# EAGLE design right_revision1_1 (EAGLE 7.2.0)
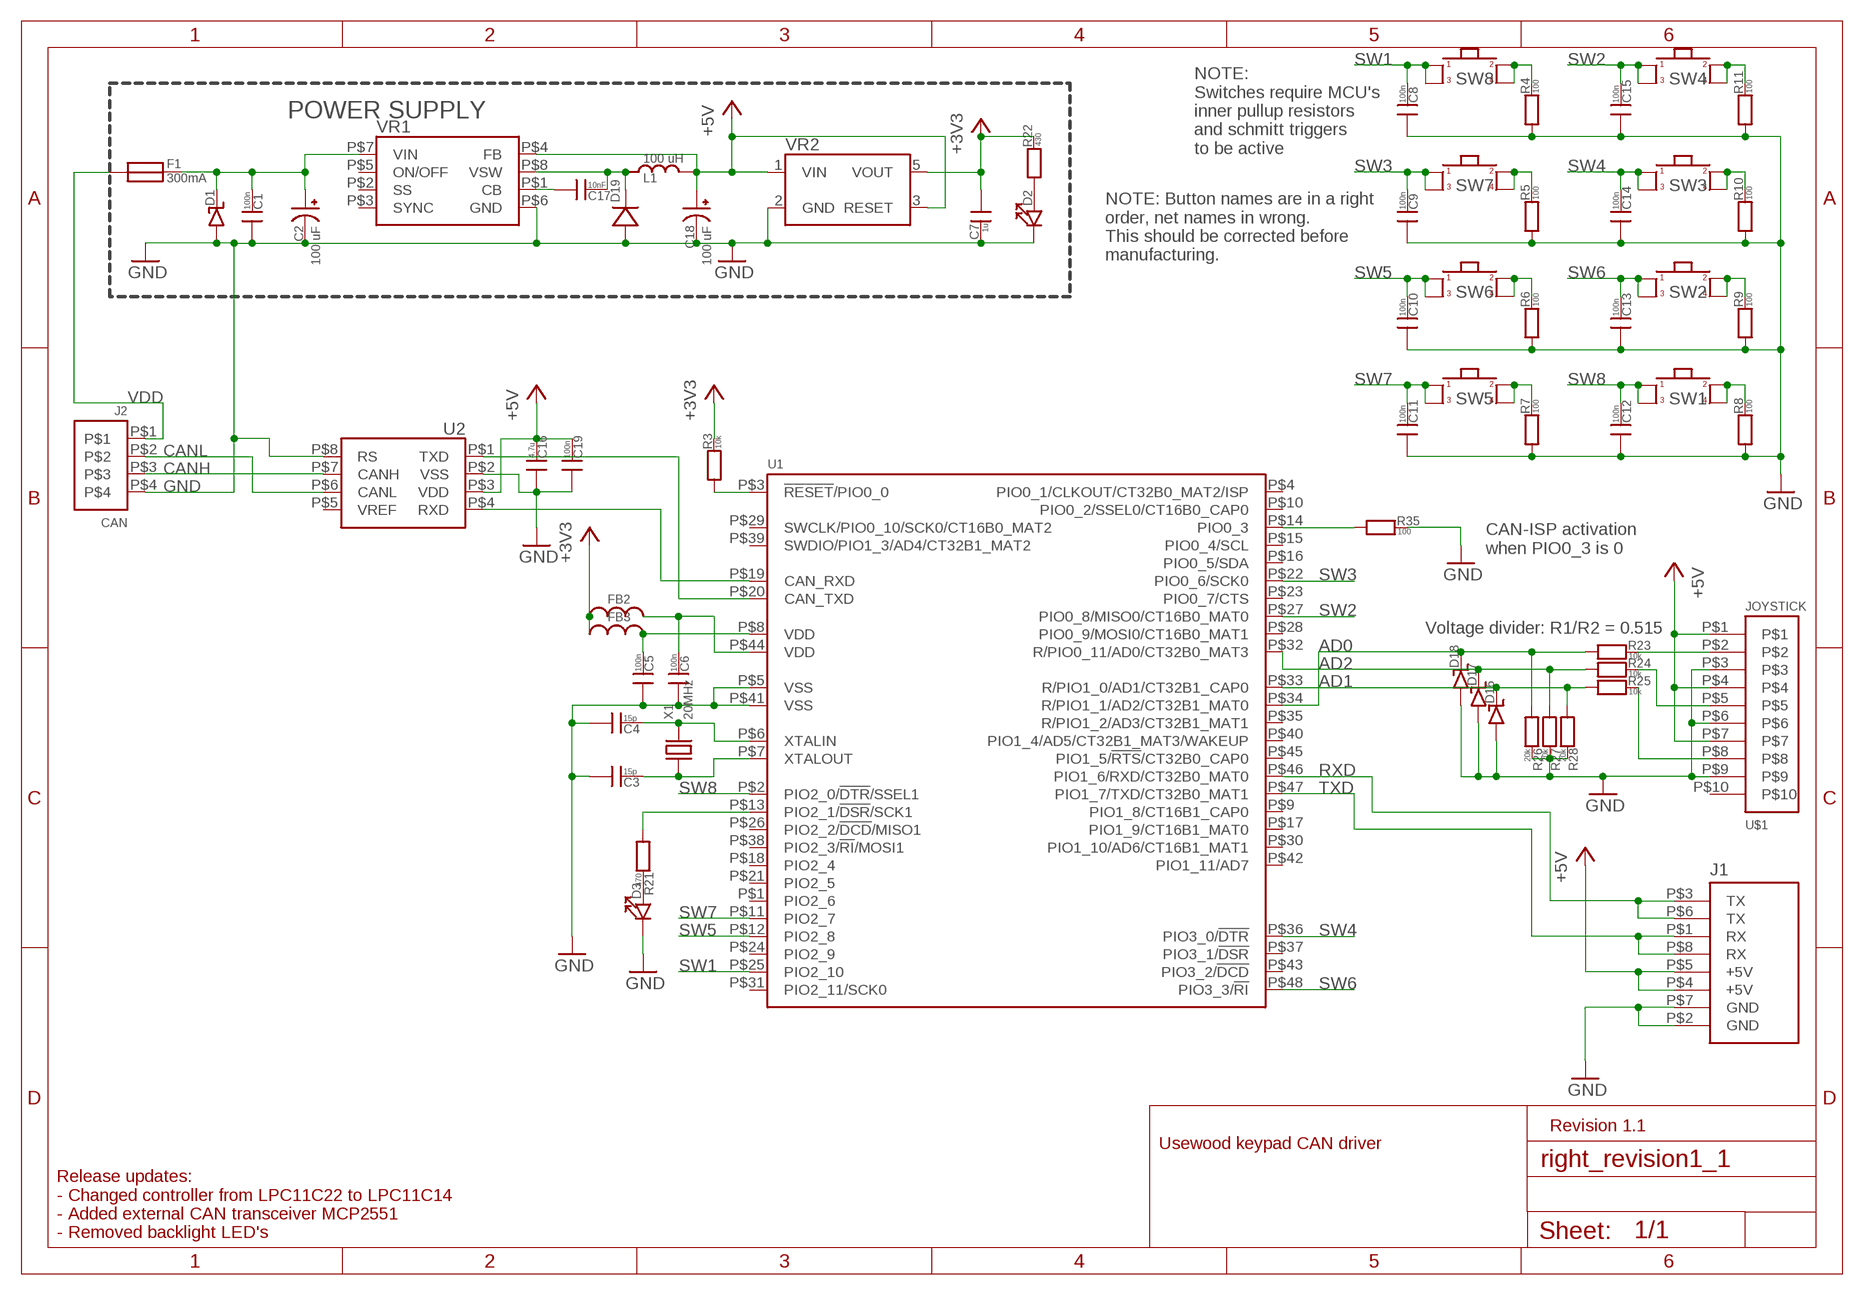
[diagram p0: schematic, sheet 1]

## Parts
C1  100n  CAP0603_SILKSCREEN  [0603_SILKSCREEN]
C2  100 uF  CAP_POLSMD_10X10X10MM  [CAP_POL_SMD_10X10X10MM]
C3  15p  CAP0603_SILKSCREEN  [0603_SILKSCREEN]
C4  15p  CAP0603_SILKSCREEN  [0603_SILKSCREEN]
C5  100n  CAP0603_SILKSCREEN  [0603_SILKSCREEN]
C6  100n  CAP0603_SILKSCREEN  [0603_SILKSCREEN]
C7  1u  CAP0603_SILKSCREEN  [0603_SILKSCREEN]
C8  100n  CAP0603_SILKSCREEN  [0603_SILKSCREEN]
C9  100n  CAP0603_SILKSCREEN  [0603_SILKSCREEN]
C10  100n  CAP0603_SILKSCREEN  [0603_SILKSCREEN]
C11  100n  CAP0603_SILKSCREEN  [0603_SILKSCREEN]
C12  100n  CAP0603_SILKSCREEN  [0603_SILKSCREEN]
C13  100n  CAP0603_SILKSCREEN  [0603_SILKSCREEN]
C14  100n  CAP0603_SILKSCREEN  [0603_SILKSCREEN]
C15  100n  CAP0603_SILKSCREEN  [0603_SILKSCREEN]
C16  4.7u  CAP0603_SILKSCREEN  [0603_SILKSCREEN]
C17  10nF  CAP0603_SILKSCREEN  [0603_SILKSCREEN]
C18  100 uF  CAP_POLSMD_10X10X10MM  [CAP_POL_SMD_10X10X10MM]
C19  100n  CAP0603_SILKSCREEN  [0603_SILKSCREEN]
D1  DIODE_TVSDO-214AA  [DO-214AB]
D2  LED0603_SILKSCREEN  [0603_SILKSCREEN]
D3  LED0603_SILKSCREEN  [0603_SILKSCREEN]
D16  DIODE_ZENERSDO123  [SOD123]
D17  DIODE_ZENERSDO123  [SOD123]
D18  DIODE_ZENERSDO123  [SOD123]
D19  DIODEDO219AB  [DO219AB]
F1  300mA  FUSE100MA  [FUSE_100MA]
FB2  FERRITE0603_SILKSCREEN  [0603_SILKSCREEN]
FB3  FERRITE0603_SILKSCREEN  [0603_SILKSCREEN]
J1  HEADER_USART_2_TH  [HEADER_USART_2_TH]
J2  CAN  MOLEX_MICRO-FIT_4WAYTH  [MOLEX_MICRO-FIT_4WAY]
L1  100 uH  INDUCTORBOURNS_10X13X5MM  [INDUCTOR_BOURNS_10X13X5MM]
R3  10k  RES0604_SILKSCREEN  [0603_SILKSCREEN]
R4  100  RES0604_SILKSCREEN  [0603_SILKSCREEN]
R5  100  RES0604_SILKSCREEN  [0603_SILKSCREEN]
R6  100  RES0604_SILKSCREEN  [0603_SILKSCREEN]
R7  100  RES0604_SILKSCREEN  [0603_SILKSCREEN]
R8  100  RES0604_SILKSCREEN  [0603_SILKSCREEN]
R9  100  RES0604_SILKSCREEN  [0603_SILKSCREEN]
R10  100  RES0604_SILKSCREEN  [0603_SILKSCREEN]
R11  100  RES0604_SILKSCREEN  [0603_SILKSCREEN]
R21  470  RES0604_SILKSCREEN  [0603_SILKSCREEN]
R22  430  RES0604_SILKSCREEN  [0603_SILKSCREEN]
R23  10k  RES0604_SILKSCREEN  [0603_SILKSCREEN]
R24  10k  RES0604_SILKSCREEN  [0603_SILKSCREEN]
R25  10k  RES0604_SILKSCREEN  [0603_SILKSCREEN]
R26  20k  RES0604_SILKSCREEN  [0603_SILKSCREEN]
R27  20k  RES0604_SILKSCREEN  [0603_SILKSCREEN]
R28  20k  RES0604_SILKSCREEN  [0603_SILKSCREEN]
R35  100  RES0604_SILKSCREEN  [0603_SILKSCREEN]
SW1  SWITCH12X12MM_CENTER_HOLE  [SWITCH_12X12MM_CENTER_HOLE]
SW2  SWITCH12X12MM_CENTER_HOLE  [SWITCH_12X12MM_CENTER_HOLE]
SW3  SWITCH12X12MM_CENTER_HOLE  [SWITCH_12X12MM_CENTER_HOLE]
SW4  SWITCH12X12MM_CENTER_HOLE  [SWITCH_12X12MM_CENTER_HOLE]
SW5  SWITCH12X12MM_CENTER_HOLE  [SWITCH_12X12MM_CENTER_HOLE]
SW6  SWITCH12X12MM_CENTER_HOLE  [SWITCH_12X12MM_CENTER_HOLE]
SW7  SWITCH12X12MM_CENTER_HOLE  [SWITCH_12X12MM_CENTER_HOLE]
SW8  SWITCH12X12MM_CENTER_HOLE  [SWITCH_12X12MM_CENTER_HOLE]
U1  LPC11C14_QFP48  [QFP48]
U2  MCP2551_SOIC8  [SOIC8]
U$1  JOYSTICK  MOLEX_MICRO-FIT_10WAYTH  [MOLEX-MICRO-FIT_10WAY]
VR1  LM2671SOIC8  [SOIC8]
VR2  LP2985SOP5  [SOP5]
X1  20MHz  XTALSMD_5X3.2  [XTAL_SMD_5X3.2]

## Nets
+3V3: C7.0 FB2.0 FB3.0 R3.1 R22.1 VR2.5(VOUT)
+5V: C16.1 C18.+ C19.1 J1.P$4(+5V) J1.P$5(+5V) L1.P$2 U2.P$3(VDD) U$1.P$1 U$1.P$4 U$1.P$7 VR1.P$4(FB) VR2.1(VIN) VR2.3(RESET)
AD0: D18.P$2(N) R23.0 R26.0 U1.P$34(R/PIO1_1/AD2/CT32B1_MAT0)
AD1: D16.P$2(N) R25.0 R28.0 U1.P$33(R/PIO1_0/AD1/CT32B1_CAP0)
AD2: D17.P$2(N) R24.0 R27.0 U1.P$32(R/PIO0_11/AD0/CT32B0_MAT3)
CAN_ISP: R35.0 U1.P$14(PIO0_3)
CANH: J2.P$3 U2.P$7(CANH)
CANL: J2.P$2 U2.P$6(CANL)
GND: C1.0 C2.- C3.0 C4.0 C5.0 C6.0 C7.1 C8.0 C9.0 C10.0 C11.0 C12.0 C13.0 C14.0 C15.0 C16.0 C18.- C19.0 D1.P$1(P) D2.1 D3.1 D16.P$1(P) D17.P$1(P) D18.P$1(P) D19.P$1(P) J1.P$2(GND) J1.P$7(GND) J2.P$4 R4.0 R5.0 R6.0 R7.0 R8.0 R9.0 R10.0 R11.0 R26.1 R27.1 R28.1 R35.1 U1.P$5(VSS) U1.P$41(VSS) U2.P$2(VSS) U2.P$8(RS) U$1.P$3 U$1.P$6 U$1.P$9 VR1.P$6(GND) VR2.2(GND)
LED3: D3.0 R21.1
N$1: C1.1 C2.+ D1.P$2(N) F1.P$2 VR1.P$7(VIN)
N$2: C6.1 FB2.1 U1.P$44(VDD)
N$3: D2.0 R22.0
N$4: C17.1 D19.P$2(N) L1.P$1 VR1.P$8(VSW)
N$5: R21.0 U1.P$13(PIO2_1/!DSR!/SCK1)
N$12: R4.1 SW8.P$3 SW8.P$4
N$13: R5.1 SW7.P$3 SW7.P$4
N$14: R6.1 SW6.P$3 SW6.P$4
N$15: R11.1 SW4.P$3 SW4.P$4
N$16: R9.1 SW2.P$3 SW2.P$4
N$17: R10.1 SW3.P$3 SW3.P$4
N$18: R8.1 SW1.P$3 SW1.P$4
N$19: R7.1 SW5.P$3 SW5.P$4
N$20: U1.P$20(CAN_TXD) U2.P$1(TXD)
N$21: U1.P$19(CAN_RXD) U2.P$4(RXD)
N$26: C5.1 FB3.1 U1.P$8(VDD)
N$27: C17.0 VR1.P$1(CB)
N$28: C3.1 U1.P$7(XTALOUT) X1.P$1
RESET: R3.0 U1.P$3(!RESET!/PIO0_0)
RXD: J1.P$3(TX) J1.P$6(TX) U1.P$46(PIO1_6/RXD/CT32B0_MAT0)
SW1: C8.1 SW8.P$1 SW8.P$2 U1.P$25(PIO2_10)
SW2: C15.1 SW4.P$1 SW4.P$2 U1.P$27(PIO0_8/MISO0/CT16B0_MAT0)
SW3: C9.1 SW7.P$1 SW7.P$2 U1.P$22(PIO0_6/SCK0)
SW4: C14.1 SW3.P$1 SW3.P$2 U1.P$36(PIO3_0/!DTR)
SW5: C10.1 SW6.P$1 SW6.P$2 U1.P$12(PIO2_8)
SW6: C13.1 SW2.P$1 SW2.P$2 U1.P$48(PIO3_3/!RI)
SW7: C11.1 SW5.P$1 SW5.P$2 U1.P$11(PIO2_7)
SW8: C12.1 SW1.P$1 SW1.P$2 U1.P$2(PIO2_0/!DTR!/SSEL1)
TXD: J1.P$1(RX) J1.P$8(RX) U1.P$47(PIO1_7/TXD/CT32B0_MAT1)
VDD: F1.P$1 J2.P$1
XJOY: R23.1 U$1.P$2
XTALIN: C4.1 U1.P$6(XTALIN) X1.P$2
YJOY: R24.1 U$1.P$5
ZJOY: R25.1 U$1.P$8
Unconnected: U1.P$1(PIO2_6) U1.P$4(PIO0_1/CLKOUT/CT32B0_MAT2/ISP) U1.P$9(PIO1_8/CT16B1_CAP0) U1.P$10(PIO0_2/SSEL0/CT16B0_CAP0) U1.P$15(PIO0_4/SCL) U1.P$16(PIO0_5/SDA) U1.P$17(PIO1_9/CT16B1_MAT0) U1.P$18(PIO2_4) U1.P$21(PIO2_5) U1.P$23(PIO0_7/CTS) U1.P$24(PIO2_9) U1.P$26(PIO2_2/!DCD!/MISO1) U1.P$28(PIO0_9/MOSI0/CT16B0_MAT1) U1.P$29(SWCLK/PIO0_10/SCK0/CT16B0_MAT2) U1.P$30(PIO1_10/AD6/CT16B1_MAT1) U1.P$31(PIO2_11/SCK0) U1.P$35(R/PIO1_2/AD3/CT32B1_MAT1) U1.P$37(PIO3_1/!DSR) U1.P$38(PIO2_3/!RI!/MOSI1) U1.P$39(SWDIO/PIO1_3/AD4/CT32B1_MAT2) U1.P$40(PIO1_4/AD5/CT32B1_MAT3/WAKEUP) U1.P$42(PIO1_11/AD7) U1.P$43(PIO3_2/!DCD) U1.P$45(PIO1_5/!RTS!/CT32B0_CAP0) U2.P$5(VREF) U$1.P$10 VR1.P$2(SS) VR1.P$3(SYNC) VR1.P$5(ON/OFF)

## Notes on the sheet
- POWER SUPPLY
- NOTE:
  Switches require MCU's
  inner pullup resistors
  and schmitt triggers
  to be active
- NOTE: Button names are in a right 
  order, net names in wrong.
  This should be corrected before
  manufacturing.
- CAN-ISP activation 
  when PIO0_3 is 0
- Voltage divider: R1/R2 = 0.515
- Revision 1.1
- Usewood keypad CAN driver
- Release updates:
  - Changed controller from LPC11C22 to LPC11C14 
  - Added external CAN transceiver MCP2551
  - Removed backlight LED's

## Library data of the parts
C1 C3-C17 C19 = usevolt:CAP
C2 C18 = usevolt:CAP_POL
D1 = arm:DIODE_TVS
D2 D3 = usevolt:LED
D16-D18 = usevolt:DIODE_ZENER
D19 = usevolt:DIODE
F1 = arm:FUSE
FB2 FB3 = usevolt:FERRITE
J1 = usevolt:HEADER_USART_2
J2 = arm:MOLEX_MICRO-FIT_4WAY: MOLEX 43045-0401 HEADER, RIGHT ANGLE, DUAL ROW, 4 WAY, 1704306
L1 = usevolt:INDUCTOR
R3-R11 R21-R28 R35 = usevolt:RES
SW1-SW8 = arm:SWITCH
U1 = usevolt:LPC11C14
U2 = usevolt:MCP2551: Microchip High-Speed CAN Transceiver Supports 1 Mb/s operation • Implements ISO-11898 standard physical layer requirements • Suitable for 12V and 24V systems • Externally-controlled slope for reduced RFI emissions • Detection of ground fault (permanent dominant) on TXD input • Power-on reset and voltage brown-out protection • An unpowered node or brown-out event will not disturb the CAN bus • Low current standby operation • Protection against damage due to short-circuit conditions (positive or negative battery voltage) • Protection against high-voltage transients • Automatic thermal shutdown protection • Up to 112 nodes can be connected • High noise immunity due to differential bus implementation • Temperature ranges: - Industrial (I): -40°C to +85°C - Extended (E): -40°C to +125°C http://www.digikey.com/product-detail/en/MCP2551T-E%2FSN/MCP2551T-E%2FSNCT-ND/4307904 http://ww1.microchip.com/downloads/en/DeviceDoc/21667f.pdf http://www.farnell.com/datasheets/657417.pdf http://fi.farnell.com/microchip/mcp2551-i-sn/ic-can-transceiver-hi-speed-smd/dp/9758569
U$1 = usevolt:MOLEX_MICRO-FIT_10WAY: MOLEX HEADER, MICRO-FIT, R/A, DUAL ROW, 10 WAY, 1012255
VR1 = usevolt:LM2671
VR2 = arm:LP2985: TEXAS INSTRUMENTS LP2985IM5-3.3 V REG LDO +3.3V, SMD, 2985, SOT235
X1 = arm:XTAL

## Board
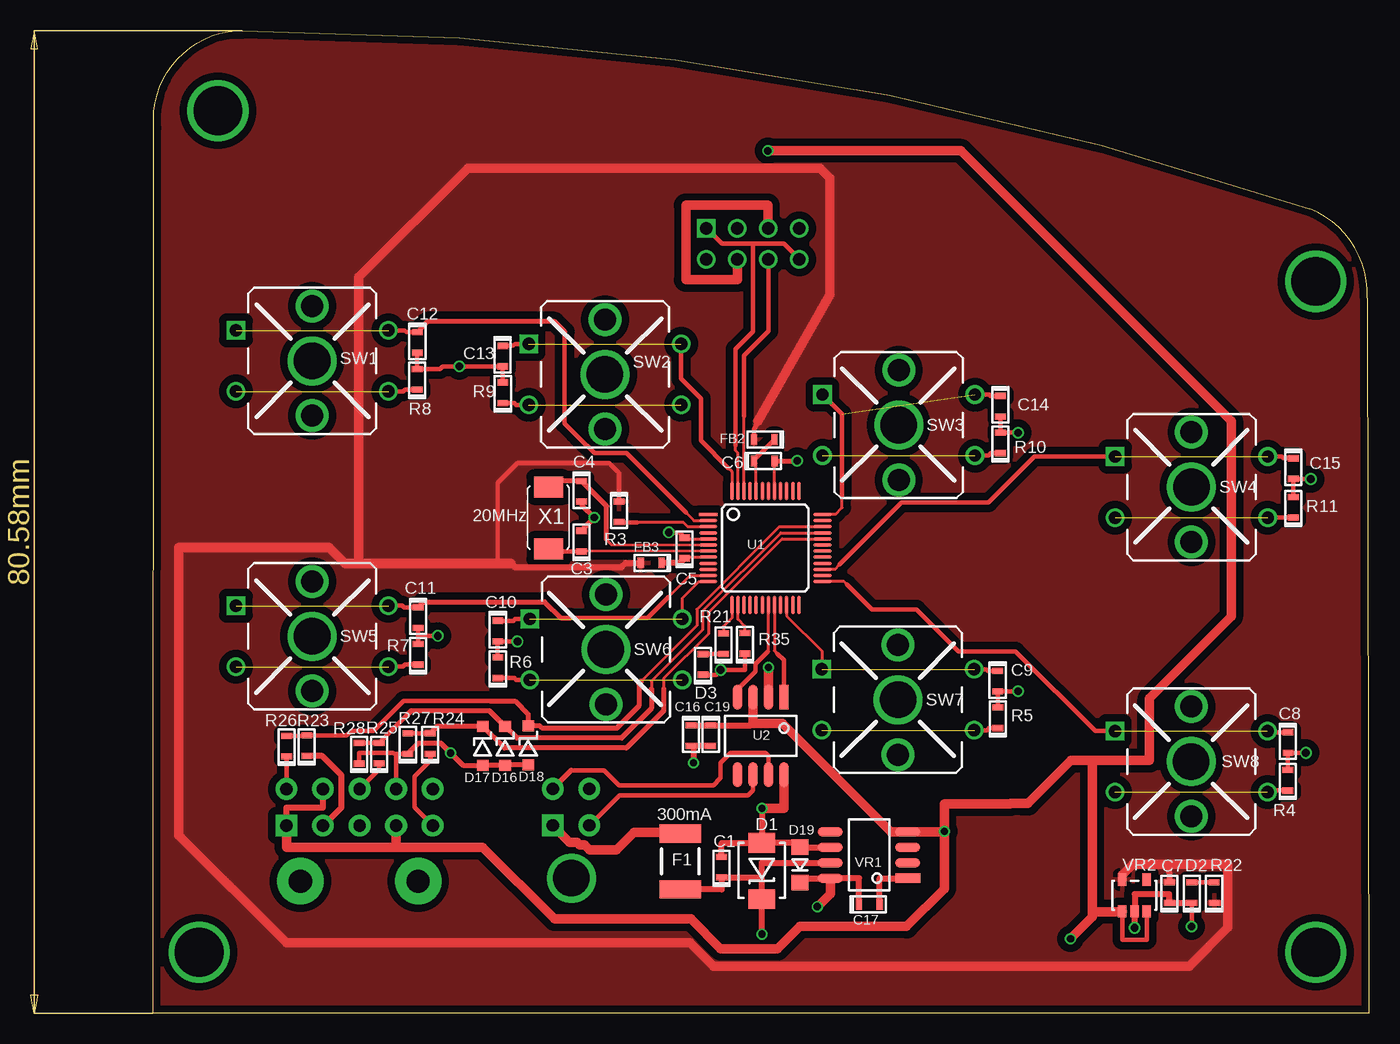
[diagram p1: board, top side]
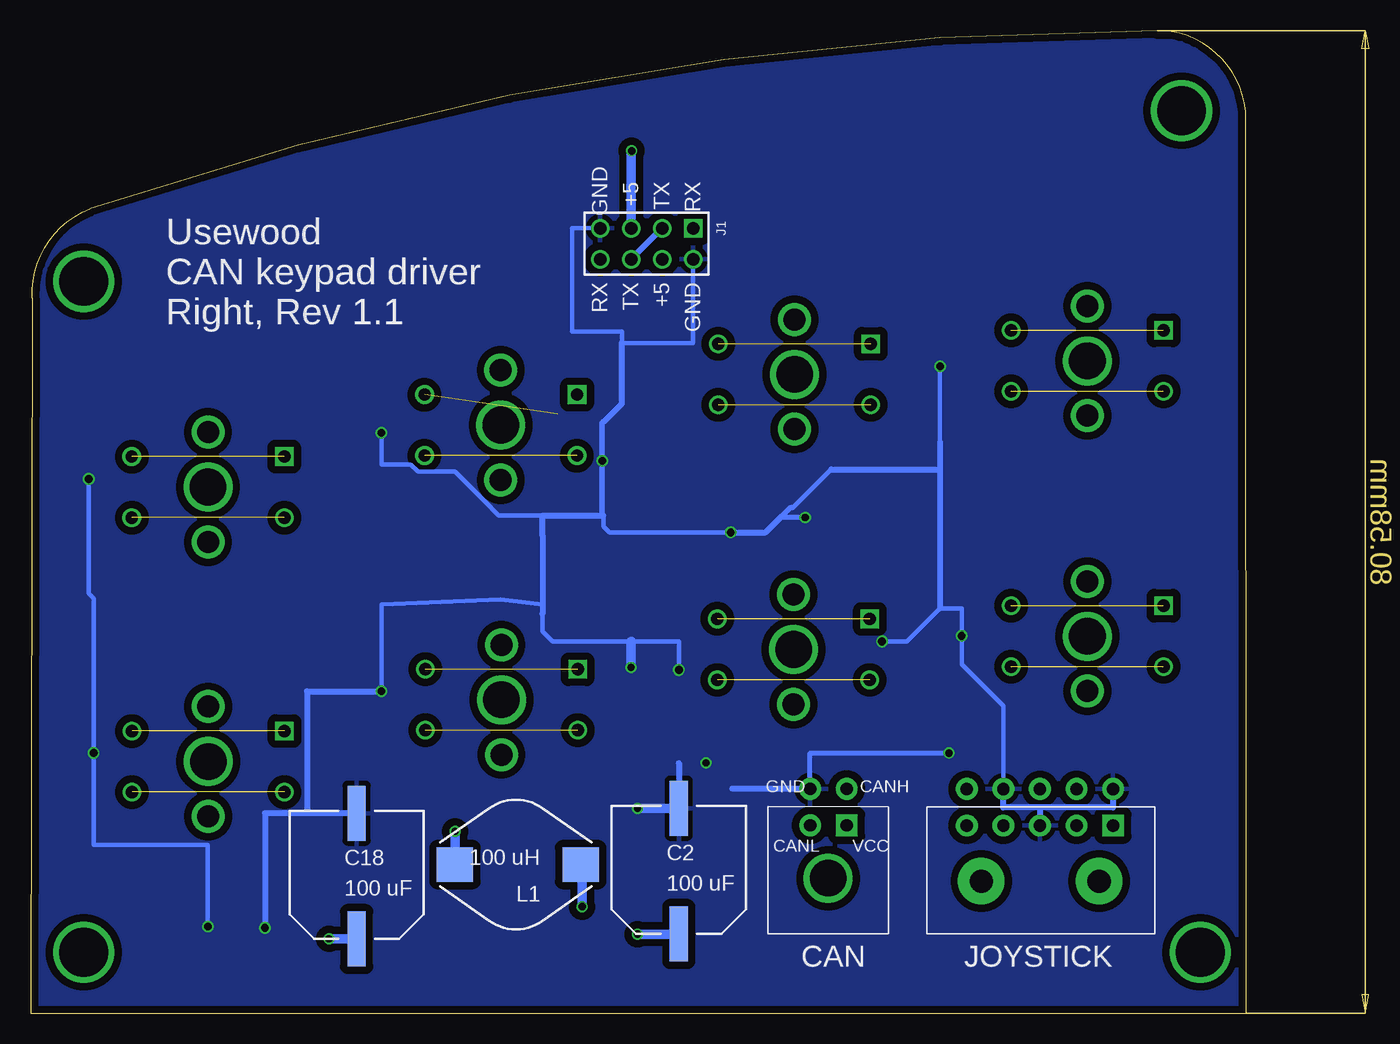
[diagram p2: board, bottom side, seen from below]

Size 99.68 x 80.58 mm. Coordinates in mm from the lower left corner, seen from the top.
Outline: 0,0 0.05,72.6 arc-90 6.81,80.58 7.31,80.58 arc-19 94.8,65.97 arc-71 99.54,58.64 99.68,0 0,0
Copper layers (1*16): Top 0.035mm / dielectric 1.5mm / Bottom 0.035mm
Design rules "SeeedStudio_2layer_DRU_no_angle_20140221 *": minimum track width 6mil, minimum drill 12mil, track to track 6mil, track to pad 6mil, pad to pad 6mil, via to via 6mil, smd to smd 0mil, copper to edge 10mil, drill to drill 10mil, minimum pad ring 10mil, minimum via ring 6mil, stop-mask expansion 2mil, vias tented up to drill 100mil, thermal gap 16mil

### Footprints (pad centres in the part's own frame; a part is rotated, then mirrored left to right if it is on the bottom)
0603_SILKSCREEN = smd 0.508 x 0.889: 0 -1.041,0; 1 0.648,0
CAP_POL_SMD_10X10X10MM = smd 1.5 x 4.5: + 0,0; - 0,10.3
DO-214AB = smd 1.62 x 2.18: P$1 0,0; P$2 4.6,0
SOD123 = smd 0.9 x 0.95: P$1 0,0; P$2 3.2,0
DO219AB = smd 1.3 x 1.4: P$1 0,0; P$2 2.9,0
FUSE_100MA = smd 1.5 x 3.41: P$1 0,0; P$2 4.572,0
HEADER_USART_2_TH = drill 1.016 square: P$1 1.27,8.89 | drill 1.016: P$2 3.81,8.89; P$3 1.27,6.35; P$4 3.81,6.35; P$5 1.27,3.81; P$6 3.81,3.81; P$7 1.27,1.27; P$8 3.81,1.27
MOLEX_MICRO-FIT_4WAY = drill 1.016 pad 1.778 square: P$1 1.27,2.032 | drill 1.016 pad 1.778: P$2 -1.727,2.032; P$3 1.27,5.029; P$4 -1.727,5.029 | drill 3: P$5 -0.25,-2.3
INDUCTOR_BOURNS_10X13X5MM = smd 3 x 2.8: P$1 -1.5,0; P$2 8.8,0
SWITCH_12X12MM_CENTER_HOLE = drill 1.016 square: P$1 -3,4.75 | drill 1.016: P$2 9.5,4.75; P$3 -3,-0.25; P$4 9.5,-0.25 | drill 3 pad 2.9: P$5 3.25,2.25 | drill 1.8 pad 1.7: P$10 3.25,6.75; P$11 3.25,-2.25
QFP48 = smd 1.5 x 0.28: P$1 0.2,0; P$2 0.2,-0.5; P$3 0.2,-1; P$4 0.2,-1.5; P$5 0.2,-2; P$6 0.2,-2.5; P$7 0.2,-3; P$8 0.2,-3.5; P$9 0.2,-4; P$10 0.2,-4.5; P$11 0.2,-5; P$12 0.2,-5.5; P$25 9.55,-5.5; P$26 9.55,-5; P$27 9.55,-4.5; P$28 9.55,-4; P$29 9.55,-3.5; P$30 9.55,-3; P$31 9.55,-2.5; P$32 9.55,-2; P$33 9.55,-1.5; P$34 9.55,-1; P$35 9.55,-0.5; P$36 9.55,0 | smd 0.28 x 1.5: P$13 2.125,-7.425; P$14 2.625,-7.425; P$15 3.125,-7.425; P$16 3.625,-7.425; P$17 4.125,-7.425; P$18 4.625,-7.425; P$19 5.125,-7.425; P$20 5.625,-7.425; P$21 6.125,-7.425; P$22 6.625,-7.425; P$23 7.125,-7.425; P$24 7.625,-7.425; P$37 7.625,1.925; P$38 7.125,1.925; P$39 6.625,1.925; P$40 6.125,1.925; P$41 5.625,1.925; P$42 5.125,1.925; P$43 4.625,1.925; P$44 4.125,1.925; P$45 3.625,1.925; P$46 3.125,1.925; P$47 2.625,1.925; P$48 2.125,1.925
SOIC8 = smd 2.032 x 0.762: P$1 -2.54,2.54; P$2 -2.54,1.27; P$3 -2.54,0; P$4 -2.54,-1.27; P$5 3.81,-1.27; P$6 3.81,0; P$7 3.81,1.27; P$8 3.81,2.54
MOLEX-MICRO-FIT_10WAY = drill 1.016 pad 1.778 square: P$1 0,-0.508 | drill 1.016 pad 1.778: P$2 -2.997,-0.508; P$3 -5.994,-0.508; P$4 -8.992,-0.508; P$5 -11.989,-0.508; P$6 0,2.489; P$7 -2.997,2.489; P$8 -5.994,2.489; P$9 -8.992,2.489; P$10 -11.989,2.489 | drill 1.905 pad 3.81: P$11 -10.795,-5.08; P$12 -1.143,-5.08
SOP5 = smd 0.7 x 1: 1 -1,0; 2 0,0; 3 1,0; 4 1,2.6; 5 -1,2.6
XTAL_SMD_5X3.2 = smd 1.7 x 2.4: P$1 -2.54,0; P$2 2.54,0

### Placement (x,y rotation side)
C1  46.6,11.78 270 top
C2  46.53,6.5 0 bottom
C3  35.12,38.52 270 top
C4  35.13,42.99 90 top
C5  43.56,37.95 270 top
C6  49.91,45.28 180 top
C7  83.31,9.71 270 top
C8  93.04,22.39 90 top
C9  69.24,27.41 90 top
C10  28.26,31.53 90 top
C11  21.71,32.63 90 top
C12  21.66,55.19 90 top
C13  28.66,54.07 90 top
C14  69.47,49.97 90 top
C15  93.48,44.85 90 top
C16  44.09,22.96 90 top
C17  58.52,8.94 180 top
C18  72.95,6.1 0 bottom
C19  45.72,22.96 90 top
D1  49.9,13.97 270 top
D2  85.14,9.7 270 top
D3  45.07,28.4 270 top
D16  28.85,20.32 90 top
D17  27.03,20.32 90 top
D18  30.76,20.35 90 top
D19  53.03,13.61 270 top
F1  43.22,14.73 270 top
FB2  50.29,47.04 0 top
FB3  41.02,36.93 0 top
J1  54.25,65.63 270 bottom
J2  34.04,13.37 0 bottom
L1  56.08,12.19 180 bottom
R3  38.19,41.31 90 top
R4  93.04,18.9 270 top
R5  69.25,24.03 270 top
R6  28.26,28.13 270 top
R7  21.72,29.23 270 top
R8  21.65,51.79 270 top
R9  28.67,50.69 270 top
R10  69.46,46.57 270 top
R11  93.48,41.28 270 top
R21  46.75,30.09 270 top
R22  86.98,9.7 270 top
R23  12.6,21.74 270 top
R24  22.72,21.91 270 top
R25  18.53,21.13 270 top
R26  10.94,21.7 270 top
R27  20.88,21.91 270 top
R28  16.88,21.12 270 top
R35  48.54,30.13 270 top
SW1  9.79,51.24 0 top
SW2  33.8,50.13 0 top
SW3  57.88,45.97 0 top
SW4  81.88,40.89 0 top
SW5  9.79,28.66 0 top
SW6  33.87,27.58 0 top
SW7  57.83,23.44 0 top
SW8  81.86,18.39 0 top
U1  45.31,40.89 0 top
U2  49.17,23.37 270 top
U$1  10.93,15.9 0 bottom
VR1  59.33,13.61 180 top
VR2  80.46,8.36 0 top
X1  32.42,40.61 90 top

### Tracks (layer width: path | path; a pad name or v marks a point on that pad's centre or on a via)
+3V3
  Top 0.381: R3.1 38.19,44.31 37.39,45.11 29.87,45.11 28.24,43.48 28.24,36.88 | 49.58,48.56 49.25,47.83 FB2.0
  Top 0.508: R22.1 88.12,9.05 | 83.29,12.2 C7.0 | 29.36,36.88 29.67,36.58 38.41,36.58 38.77,36.93 FB3.0
  Top 0.635: VR2.5 79.46,11.35
  Top 0.762: 79.46,11.35 80.31,12.2 83.29,12.2 88.12,12.2 88.12,9.05 88.12,7.04 84.94,3.86 45.92,3.86 44.01,5.78 10.93,5.78 2.11,14.6 2.11,38.2 14.43,38.2 15.75,36.88 16.86,36.88 | 29.36,36.88 28.24,36.88 16.86,36.88 | 16.86,36.88 16.86,60.35 25.81,69.29 54.66,69.29 55.47,68.48 55.47,58.93 49.58,48.56
  pour Top (isolate 0.61): 99.68,0 98.83,55.38 arc41 98.87,61.57 arc28 95.09,65.57 arc9 87.31,68.37 arc-1 70.51,73.18 arc5 53.71,76.78 arc6 25.71,79.98 arc3 8.91,80.58 arc1 6.51,80.58 arc15 5.11,80.38 arc5 2.71,79.58 arc27 0.11,77.78 arc39 0.15,72.8 0,0
+5V  (via drill 0.6)
  Top 0.381: VR2.1 79.46,6 81.46,6 VR2.3
  Top 0.508: VR2.1 79.46,8.4 | U$1.P$1 10.93,16.87 13.93,16.87 U$1.P$7 | U$1.P$4 | C16.1 C19.1 49.01,23.61 49.17,23.77
  Top 0.762: U$1.P$4 19.91,13.61 | 19.91,13.61 10.93,13.61 U$1.P$1 | v64.87,14.91 64.87,17.15 70.28,17.15 70.28,17.2 71.3,17.2 71.73,17.2 75.26,20.73 77.01,20.73 | v64.87,14.91 64.85,14.88 VR1.P$4 60.5,14.88 51.61,23.77 49.17,23.77 U2.P$3 | v64.87,14.91 64.87,10.21 61.77,7.11 53.04,7.11 51.21,5.28 46.53,5.28 44.09,7.72 32.92,7.72 27.03,13.61 19.91,13.61 | J1.P$4 47.9,60.15 43.69,60.15 43.69,66.24 50.39,66.24 50.39,64.36 J1.P$5 | v50.39,70.71 66.24,70.71 88.39,48.56 88.39,32.51 81.69,25.81 81.69,20.73 77.01,20.73 | v75.21,6.1 77.01,7.9 77.01,8.33 | 77.01,8.33 77.01,20.73 | VR2.1 79.43,8.33 77.01,8.33
  Bottom 0.762: U$1.P$4 | v64.87,14.91 64.87,12.2 L1.P$2 | C18.+ v75.21,6.1 | v50.39,70.71 50.44,70.66 J1.P$5
AD0
  Top 0.254: 40.03,27.23 44.58,31.77 44.58,33.12 51.35,39.89 U1.P$34
  Top 0.381: 27.64,25.6 20.52,25.6 18.08,23.16 16.26,23.16 15.87,22.78 R23.0 12.57,22.75 R26.0
  Top 0.406: 40.03,27.23 39.83,27.03 39.83,25.2 38,23.37 31.9,23.37 31.72,23.55 D18.P$2 30.76,24.51 29.67,25.6 27.64,25.6
AD1
  Top 0.254: 40.84,26.62 40.84,27.23 45.06,31.45 45.06,32.99 51.46,39.39 U1.P$33
  Top 0.381: R28.0 R25.0 20.75,24.39
  Top 0.406: 40.84,26.62 40.84,24.99 38.4,22.55 29.82,22.55 D16.P$2 27.58,24.79 21.15,24.79 20.75,24.39
AD2
  Top 0.254: 41.86,26.62 41.86,27.43 45.52,31.09 45.52,32.84 51.57,38.89 U1.P$32
  Top 0.381: R24.0 R27.0
  Top 0.406: 41.86,26.62 41.86,24.79 38.81,21.74 28.8,21.74 D17.P$2 23.29,23.52 R24.0
CAN_ISP
  Top 0.254: R35.0 48.54,31.73 47.94,32.33 U1.P$14
CANH
  Top 0.381: U2.P$7 50.44,21.08 50.19,21.34 47.34,21.34 46.53,20.52 46.53,19.3 45.92,18.69 38.2,18.69 36.98,19.91 34.28,19.91
  Top 0.406: 34.28,19.91 J2.P$3
CANL
  Top 0.381: U2.P$6 49.17,18.29 48.77,17.88 38.24,17.88 J2.P$2
GND  (via drill 0.6, 0.64)
  Top 0.254: C5.0 43.89,39.01 44.03,38.88 44.04,38.89 U1.P$5 | U1.P$41 50.94,45.26 C6.0
  Top 0.381: R11.0 C15.0 94.71,43.81 v94.91,43.8 | C14.0 R10.0 v70.91,47.61 v70.91,47.6 | R5.0 69.25,26.36 C9.0 70.91,26.37 v70.91,26.4 | R9.0 C13.0 | C13.0 | C12.0 R8.0 23.54,52.83 23.75,53.04 v25.11,53.04 v25.11,53.03 C13.0 | R7.0 21.72,30.89 | 21.72,30.89 C11.0 | v94.51,21.35 C8.0 R4.0 | R35.1 48.54,28.14 v46.52,28.14 46.13,27.75 D3.1 | v42.27,39.42 43.16,39.42 C5.0 | R6.0 C10.0 28.27,30.48 v29.87,30.48 | v23.33,30.94 21.72,30.94 21.72,30.89 | R28.1 16.88,21.36 19.68,21.36 19.79,21.26 19.91,21.26 | 19.91,21.26 R27.1 | 19.91,21.26 19.91,19.82 19.92,19.81 U$1.P$9 | U$1.P$6 10.94,18.4 R26.1 | D2.1 v85.14,7.12 v85.14,7.11
  Top 0.406: D18.P$1 28.88,20.34 D16.P$1 D17.P$1 25.4,20.32 v24.38,21.34 23.57,22.15 21.77,22.15 R27.1 | C6.0 v52.81,45.28 v52.81,45.29 | C3.0 35.12,39.59 v36.17,40.64 35.12,41.68 C4.0
  Top 0.508: 80.47,6.98 v80.46,7 VR2.2 80.47,9.75 83.31,9.75 C7.1 84.93,9.06 D2.1 | VR1.P$6 D19.P$1 52.68,13.96 D1.P$1 | D1.P$1 46.6,13.96 C1.0 | v49.91,16.79 D1.P$1 | C19.0 C16.0 arc-90 44.3,21.72 v44.3,20.52
  Top 0.762: U2.P$8 51.71,16.79 v49.91,16.79 | U2.P$2 v50.44,28.35
  Bottom 0.381: 80.47,6.98 v80.47,7 v80.46,7 | v94.51,21.35 94.51,34 94.91,34.4 v94.91,43.8 | v94.51,21.35 94.51,21.26 | 25.11,46.8 v25.11,53.04 | v70.91,47.6 70.91,45 68.51,45 67.91,44.4 64.87,44.4 62.51,42.04 61.31,40.8 57.7,40.8 | 57.71,32.74 57.7,33.14 57.7,31.29 56.9,30.48 50.42,30.48 46.52,30.48 v46.52,28.14 | 57.7,39.2 57.71,39.2 | v94.51,21.35 94.51,13.82 85.14,13.82 v85.14,7.11 | U$1.P$9 19.91,25.2 23.33,28.62 v23.33,30.94 23.33,33.2 25.11,33.2 27.83,30.48 v29.87,30.48 | 34.04,44.6 37.19,41.45 | 25.21,44.6 25.11,44.5 | v42.27,39.42 52.22,39.42 52.71,39.91 52.71,40.8 | 57.71,33.53 61.16,33.93 70.91,33.53 v70.91,26.4 | 51.21,54.96 45.36,54.96 J1.P$2 | J1.P$7 55.27,64.36 55.27,55.88 51.21,55.88 51.21,54.66
  Bottom 0.406: J2.P$4 35.76,21.34 v24.38,21.34 | v36.17,40.64 38.2,40.64 | 38.2,40.64 38.4,40.44 | 37.19,41.45 37.39,41.45 38.2,40.64
  Bottom 0.457: 52.71,48.48 52.81,48.39 v52.81,45.29 52.81,40.9 52.71,40.8
  Bottom 0.508: 57.7,39.2 57.7,40.8 52.71,40.8 | 57.71,39.2 57.71,33.53 57.71,32.74 | 25.11,46.8 25.11,44.6 | 25.11,44.6 25.11,44.5 25.11,33.2 | 16.92,15.39 U$1.P$3 16.93,16.87 | U$1.P$6 10.93,16.87 16.93,16.87 | 16.93,16.87 19.92,16.87 U$1.P$9 | v42.27,39.42 39.42,39.42 38.4,40.44 38.09,40.75 | 52.71,48.48 51.21,49.99 51.21,54.66 51.21,54.96 | 34.04,44.6 25.11,44.6 | v70.91,26.4 77.01,26.4 77.01,16.4 | C18.- 77.01,16.4 | 77.01,16.4 80.46,16.4 v80.46,7 | C2.- 46.53,20.52 | J2.P$4 42.17,18.4
  Bottom 0.762: C2.- v49.91,16.79 | v50.44,28.35 50.44,30.48 50.42,30.48
  pour Bottom (isolate 0.61): 99.68,0.2 98.83,55.59 arc41 98.87,61.57 arc28 95.09,65.57 arc9 87.31,68.17 arc-1 70.51,73.38 arc5 53.71,76.98 arc6 25.71,80.18 arc3 8.91,80.78 arc1 6.51,80.78 arc15 5.11,80.58 arc5 2.71,79.78 arc27 0.11,77.98 arc39 0.15,71.58 0,0.2
LED3
  Top 0.381: R21.1 D3.0
N$1  (via drill 0.6)
  Top 0.508: 49.9,11.13 D1.P$2 v49.91,6.48 | 49.9,11.13 49.9,12.34 VR1.P$7 | 49.9,11.13 C1.1 46.6,10.15 F1.P$2
  Bottom 0.508: C2.+ 46.53,6.48
  Bottom 0.762: 46.53,6.48 v49.91,6.48
N$2
  Top 0.254: 49.27,45.13 C6.1 49.44,45.11 U1.P$44
  Top 0.381: C6.1 49.27,45.37 FB2.1
N$3
  Top 0.381: R22.0 D2.0
N$4  (via drill 0.6)
  Top 0.508: C17.1 57.87,11.07 VR1.P$8 53.4,11.07 D19.P$2
  Top 0.762: v54.46,8.74 55.52,9.8 VR1.P$8
  Bottom 0.762: L1.P$1 54.46,12.07 v54.46,8.74
N$5
  Top 0.254: U1.P$13 47.44,32.4 46.75,31.71 R21.0
N$7  (via drill 4)
  other vias: 3.76,5
N$8  (via drill 4)
  other vias: 95.31,5
N$9  (via drill 4)
  other vias: 95.31,60
N$10  (via drill 4)
  other vias: 5.31,74
N$12  (1 unrouted)
  Top 0.381: R4.1 91.47,18.25 SW8.P$4
N$13  (1 unrouted)
  Top 0.381: SW7.P$4 68.36,23.2 68.54,23.38 R5.1
N$14  (1 unrouted)
  Top 0.381: SW6.P$3 29.77,27.33 29.62,27.48 R6.1
  Top 0.406: SW6.P$3
N$15  (1 unrouted)
  Top 0.381: R11.1 SW4.P$4
N$16  (1 unrouted)
  Top 0.381: SW2.P$3 29.77,49.88 29.62,50.04 R9.1
N$17  (1 unrouted)
  Top 0.381: SW3.P$4 68.48,45.72 68.68,45.92 R10.1
N$18  (1 unrouted)
  Top 0.381: SW1.P$4 20.5,50.99 20.66,51.14 R8.1
  Top 0.406: SW1.P$4
N$19  (1 unrouted)
  Top 0.381: 19.3,28.43 20.5,28.43 20.65,28.58 R7.1
  Top 0.406: SW5.P$4 19.3,28.43
N$20
  Top 0.254: U1.P$20 50.94,29.73 51.21,29.46
  Top 0.381: 51.21,29.46 51.71,28.96 U2.P$1
N$21
  Top 0.254: 50.39,29.67 50.44,29.71 U1.P$19
  Top 0.381: U2.P$4 47.9,26.57 49.38,28.04 49.38,28.65 50.39,29.67
N$26
  Top 0.254: 43.56,37.38 C5.1 43.65,37.39 U1.P$8
  Top 0.508: C5.1 43.19,36.93 FB3.1
N$27
  Top 0.508: C17.0 59.56,11.07 VR1.P$1
N$28
  Top 0.203: U1.P$7 35.14,37.89 C3.1
  Top 0.381: C3.1 32.62,37.87 X1.P$1
RESET
  Top 0.254: 39.69,40.23 43.48,40.23 43.82,39.89 U1.P$3
  Top 0.381: 39.69,40.23 38.23,40.23 R3.0
RXD
  Top 0.254: U1.P$46 48.44,48.97
  Top 0.381: 48.44,48.97 48.44,53.92 50.44,55.93 J1.P$6
  Bottom 0.508: J1.P$6 J1.P$3
SW1  (1 unrouted)
  Top 0.254: 56.9,35.15 56.66,35.39 U1.P$25
  Top 0.381: 56.9,35.15 58.93,33.12 62.59,33.12 66.04,29.67 70.71,29.67 77.24,23.14 SW8.P$1 | C8.1 91.46,23.04 SW8.P$2
SW2  (1 unrouted)
  Top 0.254: 56.29,36.78 55.9,36.39 U1.P$27
  Top 0.381: 56.29,36.78 61.37,41.86 68.48,41.86 72.26,45.64 SW4.P$1 | C15.1 92.67,45.5 92.53,45.64 SW4.P$2
SW3  (1 unrouted)
  Top 0.254: SW7.P$1 54.83,29.7 51.94,32.59 U1.P$22
  Top 0.381: SW7.P$2 68.33,28.2 68.46,28.06 C9.1
SW4  (1 unrouted)
  Top 0.254: 56.49,42.27 56.49,41.45 55.93,40.89 U1.P$36
  Top 0.381: 56.49,42.27 56.49,49.11 SW3.P$1 | SW3.P$2 68.56,50.72 68.66,50.62 C14.1
SW5  (1 unrouted)
  Top 0.254: SW6.P$2 43.37,34.02 44.74,35.39 U1.P$12
  Top 0.381: 30.79,32.33 29.69,32.33 29.54,32.18 C10.1
  Top 0.406: 30.79,32.33 30.8,32.33 SW6.P$1
SW6  (1 unrouted)
  Top 0.254: 47.14,44.7 47.44,44.41 U1.P$48
  Top 0.381: 47.14,44.7 44.91,46.94 44.91,50.39 43.28,52.02 43.28,54.87 SW2.P$2 | SW2.P$1 29.68,54.88 29.53,54.72 C13.1
SW7  (1 unrouted)
  Top 0.254: 42.27,34.14 44.02,35.89 U1.P$11
  Top 0.381: 42.27,34.14 40.54,32.41 34.21,32.41 | 19.31,33.43 20.41,33.43 20.57,33.28 C11.1
  Top 0.406: C11.1 22.16,33.73 32.11,33.73 33.43,32.41 34.21,32.41 | SW5.P$2 19.31,33.43
SW8  (1 unrouted)
  Top 0.254: U1.P$2 44.34,40.39 43.69,41.05
  Top 0.381: C12.1 20.76,55.84 20.62,55.99 SW1.P$2 | 43.69,41.05 38.81,45.92 36.17,45.92 34.85,47.24 34.54,47.55 33.73,48.36 33.73,55.88
  Top 0.406: 33.73,55.88 32.92,56.69 22.47,56.69 C12.1
TXD
  Top 0.254: U1.P$47 47.94,45.94 47.75,46.13 47.75,46.53
  Top 0.381: 47.75,46.53 47.75,54.46 49.17,55.88 49.17,63.09 | 49.17,63.09 46.63,63.09 J1.P$1 | J1.P$8 51.71,63.09 49.17,63.09
VDD
  Top 0.762: J2.P$1 34.14,14.02 34.75,14.02 34.95,13.82 35.36,13.82 35.76,13.41 38,13.41 39.42,14.83 43.11,14.83 F1.P$1
XJOY
  Top 0.508: U$1.P$2 13.97,15.39 15.44,16.87 15.44,19.51 13.86,21.09 R23.1
XTALIN
  Top 0.203: 37.41,38.58 37.6,38.39 U1.P$6
  Top 0.254: 37.41,38.58 37.19,38.81
  Top 0.406: 37.19,38.81 37.19,41.57 C4.1 32.9,43.63 X1.P$2
YJOY
  Top 0.381: 22.72,20.69 21.44,19.41 21.44,16.88 U$1.P$5
  Top 0.406: R24.1 22.72,20.69
ZJOY
  Top 0.381: U$1.P$8 18.53,19.99 R25.1

### Text on the board
bPlace: Usewood / CAN keypad driver / Right, Rev 1.1 | CANH | GND | VCC | CANL | JOYSTICK | CAN